# Altium schematic sheet SPI_Flash.SchDoc
size A4; SheetNumber: 3; SheetTotal: 10
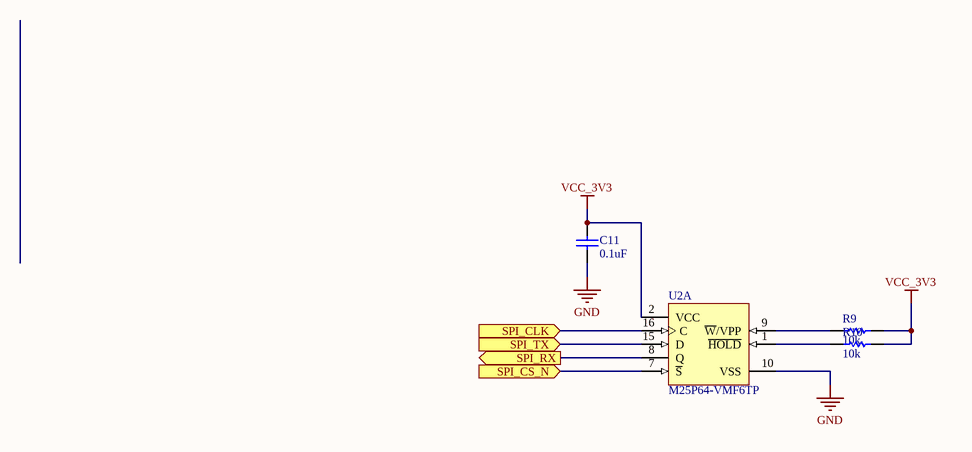
[diagram p0: SPI_Flash.SchDoc]

## Parts
C11  0.1uF  [0805_C_S]
R9  10k  [0805_R_S]
R10  10k  [0805_R_S]
U2  M25P64-VMF6TP  [MICT-MF-16_N]  (part A of 2)

## Ports
SPI_CLK (in), SPI_CS_N (in), SPI_RX (out), SPI_TX (in)

## Nets
GND: C11.1 U2.10(VSS)
VCC_3V3: C11.2 R9.1 R10.1 U2.2(VCC)
SPI_CLK: U2.16(C) ; port SPI_CLK
SPI_CS_N: U2.7(~{S}) ; port SPI_CS_N
SPI_RX: U2.8(Q) ; port SPI_RX
SPI_TX: U2.15(D) ; port SPI_TX
NetR9_2: R9.2 U2.9(~{W}/VPP)
NetR10_2: R10.2 U2.1(~{HOLD})

## Library data of the parts
C11 = Cap: Capacitor; Published: 8-Jun-2000; LatestRevisionDate: 17-Jul-2002; LatestRevisionNote: Re-released for DXP Platform.; Publisher: Altium Limited; Value: 0.1uF
R9 R10 = Res1: Resistor; Published: 8-Jun-2000; LatestRevisionDate: 17-Jul-2002; LatestRevisionNote: Re-released for DXP Platform.; Publisher: Altium Limited; Value: 10k
U2 = CMP-0357-00029-1: 64 Mb (x1) Serial NOR Flash Memory, 75 MHz, 2.7 to 3.6 V, 16-pin SO16 Wide (MF), Tape & Reel; Manufacturer: Micron; Part Family: M25PÂ; Density: 64MbÂ; Speed: 75 MHzÂ; Voltage: 2.7V-3.6VÂ; PackageVersion: Rev. A; ComponentLink1Description: Manufacturer URL; PartNumber: M25P64-VMF6TP; Package: SO16 WideÂ; Applications: EmbeddedÂ; PackageDescription: 16-Pin SO Wide, 7.5 X 10.3 mm, Pitch 1.27 mm; ComponentLink1URL: http://www.micron.com/; Mounting Technology: Surface Mount; Part Status: ProductionÂ; Width: x1Â; ComponentLink3Description: Package Specification; DatasheetVersion: Rev. 12; Type: Data StorageÂ; ComponentLink3URL: http://www.micron.com/~/media/Documents/Products/Data%20Sheet/NOR%20Flash/Serial%20NOR/M25P/M25P128.pdf; RoHS: YesÂ; ComponentLink2URL: http://www.micron.com/~/media/Documents/Products/Data%20Sheet/NOR%20Flash/Serial%20NOR/M25P/M25P64.pdf; PackageReference: MICT-MF-16; ComponentLink2Description: Datasheet